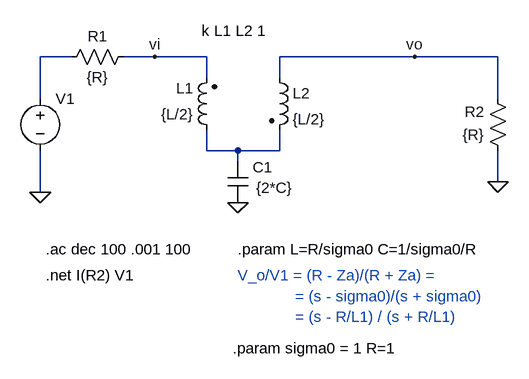
[diagram p0: schematic tee_1ord_delay_eq.asc]
tee_1ord_delay_eq.asc, the LTspice schematic file:
Version 4
SHEET 1 880 1328
WIRE 48 464 0 464
WIRE 176 464 128 464
WIRE 256 464 176 464
WIRE 576 464 368 464
WIRE 704 464 576 464
WIRE 256 496 256 464
WIRE 368 496 368 464
WIRE 0 528 0 464
WIRE 704 528 704 464
WIRE 256 608 256 576
WIRE 304 608 256 608
WIRE 368 608 368 576
WIRE 368 608 304 608
WIRE 304 624 304 608
WIRE 704 656 704 608
WIRE 0 672 0 608
FLAG 0 672 0
FLAG 176 464 vi
FLAG 576 464 vo
FLAG 304 688 0
FLAG 704 656 0
SYMBOL voltage 0 512 R0
WINDOW 3 24 96 Invisible 2
SYMATTR Value 0
SYMATTR InstName V1
SYMATTR Value2 AC 1 0
SYMATTR SpiceLine Rser=0
SYMBOL res 144 448 R90
WINDOW 0 0 56 VBottom 2
WINDOW 3 32 56 VTop 2
SYMATTR InstName R1
SYMATTR Value {R}
SYMBOL res 720 624 R180
WINDOW 0 36 76 Left 2
WINDOW 3 36 40 Left 2
SYMATTR InstName R2
SYMATTR Value {R}
SYMBOL ind2 272 592 R180
WINDOW 0 36 80 Left 2
WINDOW 3 36 40 Left 2
SYMATTR InstName L1
SYMATTR Value {L/2}
SYMATTR Type ind
SYMATTR SpiceLine Rser=0
SYMBOL ind2 352 480 R0
SYMATTR InstName L2
SYMATTR Value {L/2}
SYMATTR Type ind
SYMATTR SpiceLine Rser=0
SYMBOL cap 288 624 R0
WINDOW 0 39 10 Left 2
WINDOW 3 44 41 Left 2
SYMATTR InstName C1
SYMATTR Value {2*C}
TEXT 8 800 Left 2 !.net I(R2) V1
TEXT 8 760 Left 2 !.ac dec 100 .001 100
TEXT 248 424 Left 2 !k L1 L2 1
TEXT 304 760 Left 2 !.param L=R/sigma0 C=1/sigma0/R
TEXT 296 912 Left 2 !.param sigma0 = 1 R=1
TEXT 304 800 Left 2 ;V_o/V1 = (R - Za)/(R + Za) =
TEXT 392 832 Left 2 ;= (s - sigma0)/(s + sigma0)
TEXT 392 864 Left 2 ;= (s - R/L1) / (s + R/L1)

The netlist it stands for:
* tee_1ord_delay_eq.asc
V1 N001 0 0 AC 1 0 Rser=0
R1 vi N001 {R}
R2 0 vo {R}
L1 N002 vi {L/2} Rser=0
L2 vo N002 {L/2} Rser=0
C1 N002 0 {2*C}
.net I(R2) V1
.ac dec 100 .001 100
k L1 L2 1
.param L=R/sigma0 C=1/sigma0/R
.param sigma0 = 1 R=1
* V_o/V1 = (R - Za)/(R + Za) =
* = (s - sigma0)/(s + sigma0)
* = (s - R/L1) / (s + R/L1)
.backanno
.end